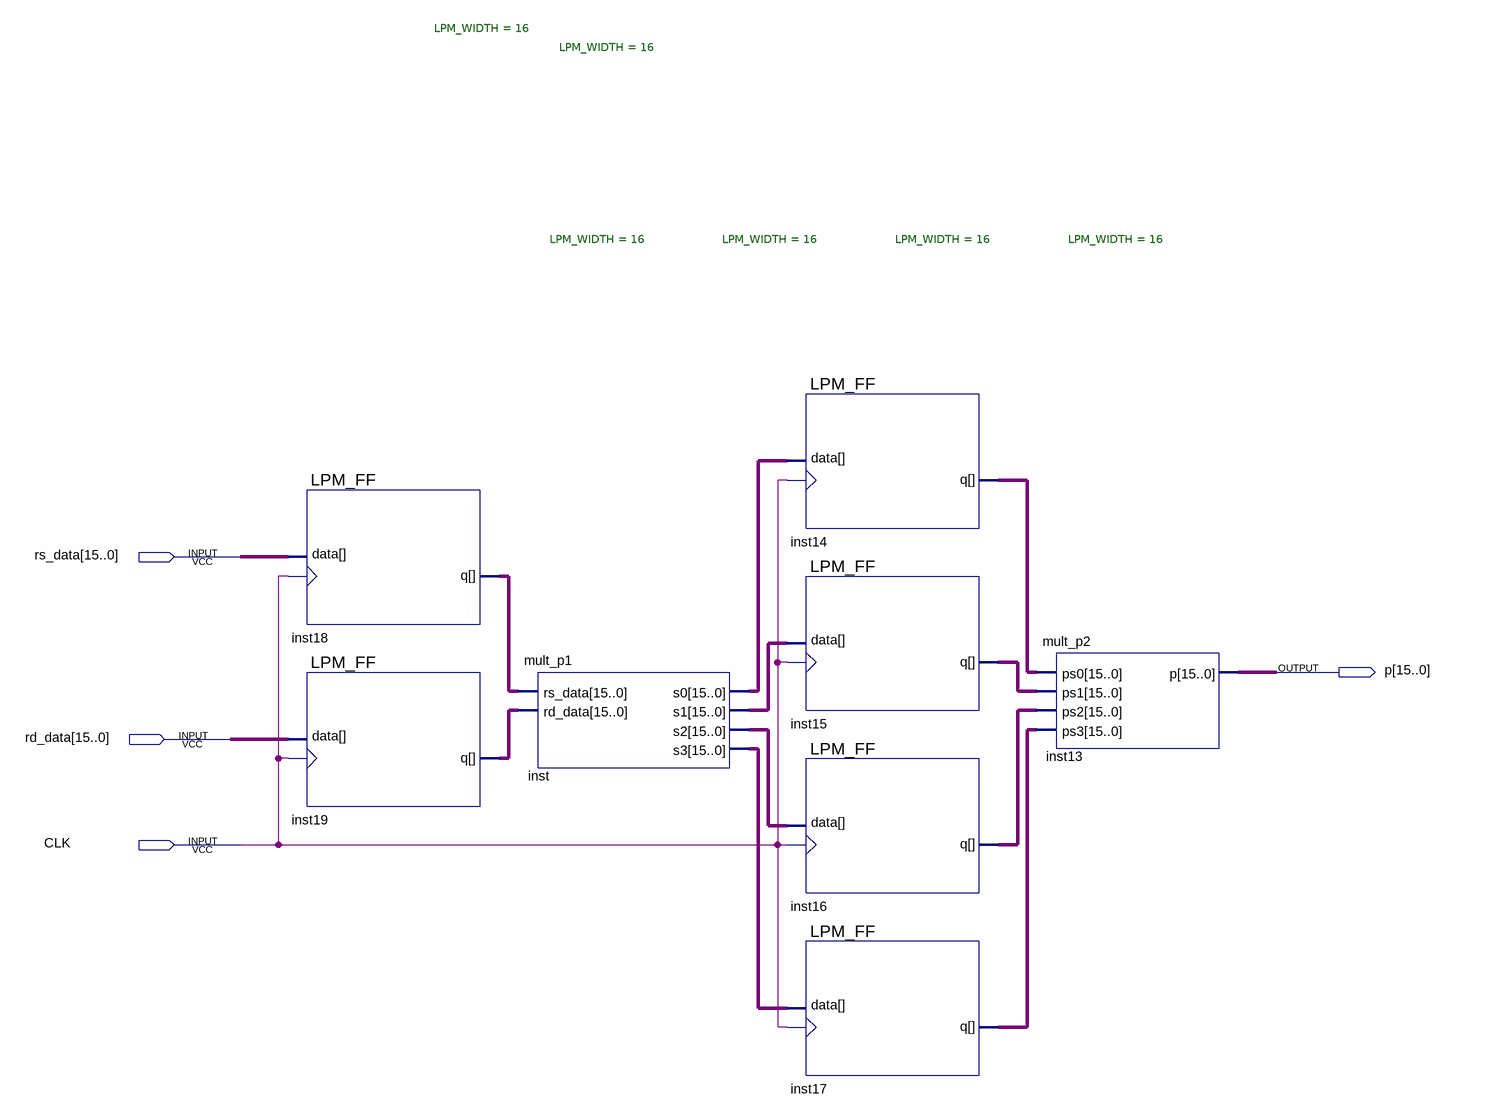
[diagram p0: schematic sheet]
// Quartus schematic old_mult_pipelined.bdf as structural Verilog: 8 symbols, 4 pins
module old_mult_pipelined (
  input  [15:0] rs_data,
  input  [15:0] rd_data,
  input  CLK,
  output [15:0] p
);

  wire [15:0] inst14_q, inst15_q, inst16_q, inst17_q, inst18_q, inst19_q, inst_s0, inst_s1, inst_s2, inst_s3;

  LPM_FF #(.LPM_WIDTH(16)) inst18 (.clock(CLK), .data(rs_data), .q(inst18_q));
  LPM_FF #(.LPM_WIDTH(16)) inst19 (.clock(CLK), .data(rd_data), .q(inst19_q));
  mult_p1 inst (.rs_data(inst18_q), .rd_data(inst19_q), .s0(inst_s0), .s1(inst_s1), .s2(inst_s2), .s3(inst_s3));
  LPM_FF #(.LPM_WIDTH(16)) inst14 (.clock(CLK), .data(inst_s0), .q(inst14_q));
  LPM_FF #(.LPM_WIDTH(16)) inst15 (.clock(CLK), .data(inst_s1), .q(inst15_q));
  LPM_FF #(.LPM_WIDTH(16)) inst16 (.clock(CLK), .data(inst_s2), .q(inst16_q));
  LPM_FF #(.LPM_WIDTH(16)) inst17 (.clock(CLK), .data(inst_s3), .q(inst17_q));
  mult_p2 inst13 (.ps0(inst14_q), .ps1(inst15_q), .ps2(inst16_q), .ps3(inst17_q), .p(p));
endmodule
